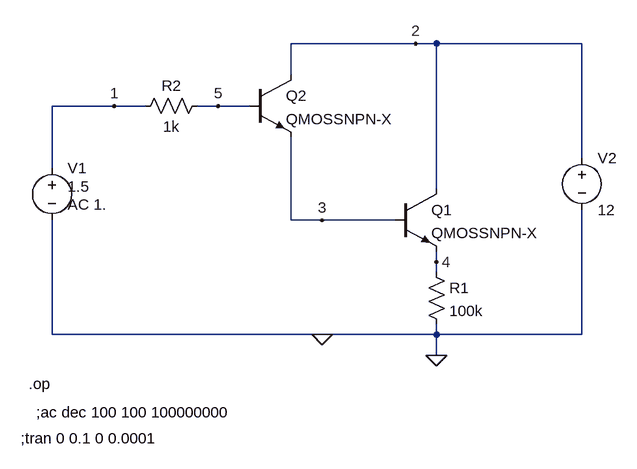
[diagram p0: schematic Draft2.asc]
Draft2.asc, the LTspice schematic file:
Version 4
SHEET 1 968 704
WIRE 592 80 400 80
WIRE 624 80 592 80
WIRE 848 80 624 80
WIRE 400 128 400 80
WIRE 128 176 32 176
WIRE 176 176 128 176
WIRE 288 176 256 176
WIRE 336 176 288 176
WIRE 848 256 848 80
WIRE 32 272 32 176
WIRE 624 304 624 80
WIRE 400 352 400 224
WIRE 448 352 400 352
WIRE 560 352 448 352
WIRE 624 416 624 400
WIRE 624 432 624 416
WIRE 32 528 32 352
WIRE 448 528 32 528
WIRE 624 528 624 512
WIRE 624 528 448 528
WIRE 848 528 848 336
WIRE 848 528 624 528
WIRE 624 560 624 528
FLAG 624 560 0
FLAG 288 176 5
FLAG 128 176 1
FLAG 592 80 2
FLAG 448 352 3
FLAG 624 416 4
FLAG 448 528 0
SYMBOL npn 336 128 R0
SYMATTR InstName Q2
SYMATTR Value QMOSSNPN-X
SYMBOL npn 560 304 R0
SYMATTR InstName Q1
SYMATTR Value QMOSSNPN-X
SYMBOL res 608 416 R0
SYMATTR InstName R1
SYMATTR Value 100k
SYMBOL res 272 160 R90
WINDOW 0 0 56 VBottom 2
WINDOW 3 32 56 VTop 2
SYMATTR InstName R2
SYMATTR Value 1k
SYMBOL voltage 32 256 R0
WINDOW 3 24 44 Left 2
WINDOW 123 24 72 Left 2
WINDOW 39 0 0 Left 2
SYMATTR InstName V1
SYMATTR Value 1.5
SYMATTR Value2 AC 1.
SYMBOL voltage 848 240 R0
WINDOW 123 0 0 Left 2
WINDOW 39 0 0 Left 2
SYMATTR InstName V2
SYMATTR Value 12
TEXT -4 604 Left 2 !.op
TEXT 8 648 Left 2 !;ac dec 100 100 100000000
TEXT -16 688 Left 2 !;tran 0 0.1 0 0.0001

The netlist it stands for:
* Draft2.asc
Q2 2 5 3 0 QMOSSNPN-X
Q1 2 3 4 0 QMOSSNPN-X
R1 4 0 100k
R2 5 1 1k
V1 1 0 1.5 AC 1.
V2 2 0 12
.model NPN NPN
.model PNP PNP
.lib standard.bjt
.op
;ac dec 100 100 100000000
;tran 0 0.1 0 0.0001
.backanno
.end

* Results of the author's LTspice run, read from the files saved beside the schematic
* Operating Point:
*   V(2) = 12 V
*   V(5) = 1.5 V
*   V(3) = 1.001 V
*   V(4) = 432.6 mV
*   V(1) = 1.5 V
*   Ic(Q1) = 4.016 µA
*   Ib(Q1) = 310.7 nA
*   Ie(Q1) = -4.326 µA
*   Ic(Q2) = 272.3 nA
*   Ib(Q2) = 38.41 nA
*   Ie(Q2) = -310.7 nA
*   I(R2) = -38.41 nA
*   I(R1) = 4.326 µA
*   I(V2) = -4.288 µA
*   I(V1) = -38.41 nA
* From the log:
*   Semiconductor Device Operating Points:
*                           --- Bipolar Transistors ---
*   Name:       q1          q2
*   Model:  qmossnpn-x  qmossnpn-x
*   Ib:       3.11e-07    3.84e-08
*   Ic:       4.02e-06    2.72e-07
*   Vbe:      5.68e-01    4.99e-01
*   Vbc:     -1.10e+01   -1.05e+01
*   Vce:      1.16e+01    1.10e+01
*   BetaDC:   1.29e+01    7.09e+00
*   Gm:       1.55e-04    1.05e-05
*   Rpi:      1.06e+05    8.69e+05
*   Rx:       5.00e+01    5.00e+01
*   Ro:       2.12e+07    3.10e+08
*   Cbe:      2.01e-13    1.36e-13
*   Cbc:      4.46e-13    4.52e-13
*   Cjs:      0.00e+00    0.00e+00
*   BetaAC:   1.65e+01    9.14e+00
*   Cbx:      0.00e+00    0.00e+00
*   Ft:       3.81e+07    2.83e+06